# Altium schematic sheet SheetPower.SchDoc
size A3
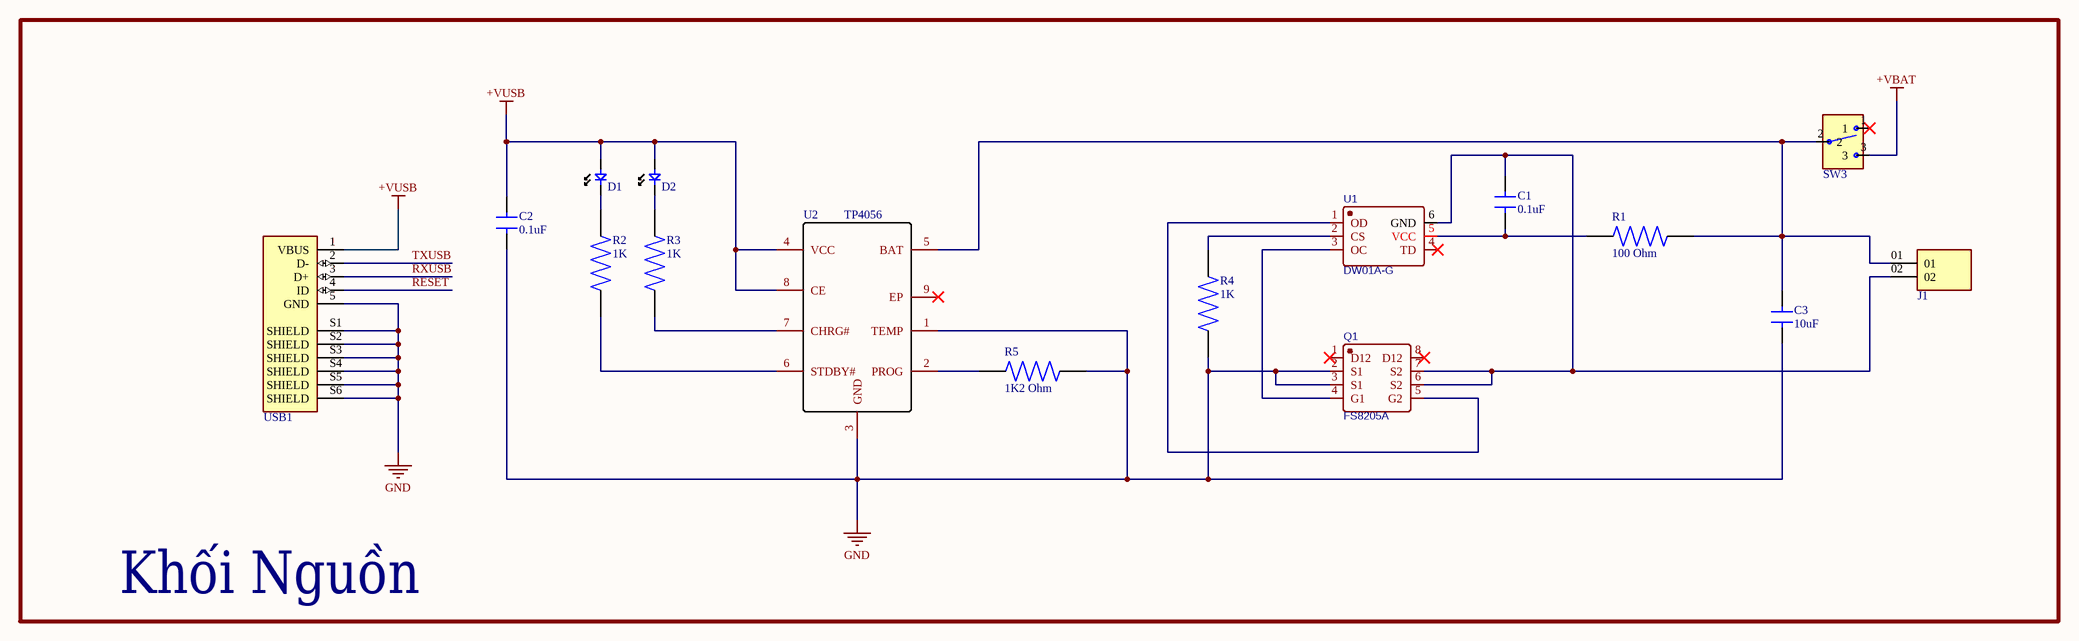
[diagram p0: SheetPower.SchDoc]

## Parts
C1  0.1uF  [CAP104 0.1UF 50V]
C2  0.1uF  [CAP104 0.1UF 50V]
C3  10uF  [CAP104 0.1UF 50V]
D1  LED SM 0805 2V 100MCD RED  [LED 0805]  (value not drawn)
D2  LED SM 0805 2V 100MCD RED  [LED 0805]  (value not drawn)
J1  HTSW-102-07-H-S  [SAMTEC_HTSW-102-07-H-S]  (value not drawn)
Q1  FS8205A  [FS8205A]
R1  100 Ohm  [RC0805 1K OHM]
R2  1K  [RC0805 1K OHM]
R3  1K  [RC0805 1K OHM]
R4  1K  [RC0805 1K OHM]
R5  1K2 Ohm  [RC0805 1K OHM]
SW3  CUS-12TB  [CUS-12B]  (value not drawn)
U1  DW01A-G  [DW01A-G]
U2  TP4056  [TP4056]
USB1  usb micro  [MOLEX_47346-0001]  (value not drawn)

## Blocks framed on the sheet
Khối Nguồn: C1-C3 D1 D2 J1 Q1 R1-R5 SW3 U1 U2 USB1

## Nets
+VBAT: SW3.3
+VUSB: C2.2 D1.A D2.A U2.4(VCC) U2.8(CE) USB1.1(VBUS)
GND: C2.1 C3.1 Q1.2(S1) Q1.3(S1) R4.1 R5.2 U2.1(TEMP) U2.3(GND) USB1.5(GND) USB1.S1(SHIELD) USB1.S2(SHIELD) USB1.S3(SHIELD) USB1.S4(SHIELD) USB1.S5(SHIELD) USB1.S6(SHIELD)
RESET: USB1.4(ID)
RXUSB: USB1.3(D+)
TXUSB: USB1.2(D-)
NetC1_1: C1.1 R1.1 U1.5(VCC)
NetC1_2: C1.2 J1.02 Q1.6(S2) Q1.7(S2) U1.6(GND)
NetC3_2: C3.2 J1.01 R1.2 SW3.2 U2.5(BAT)
NetD1_K: D1.K R2.2
NetD2_K: D2.K R3.2
NetQ1_4: Q1.4(G1) U1.3(OC)
NetQ1_5: Q1.5(G2) U1.1(OD)
NetR2_1: R2.1 U2.6(STDBY#)
NetR3_1: R3.1 U2.7(CHRG#)
NetR4_2: R4.2 U1.2(CS)
NetR5_1: R5.1 U2.2(PROG)

Not connected (* = marked no-connect by the designer): Q1 1(D12)* 8(D12)*; SW3 1*; U1 4(TD)*; U2 9(EP)*

## Library data of the parts
C1 C2 = C0805C104K5RACTU: Cap Ceramic 0.1uF 50V X7R 10% SMD 2.0 x 1.2 mm 125 C Paper T/R; Manufacturer: KEMET; Capacitance: 100nF; Voltage: 500V; Supplier 1: Digi-Key; Manufacturer Part Number: C0805C104K5RACTU; Stock 1: 2487008; Pricing 1: 1 = 0.16000, 10 = 0.11500, 50 = 0.06540, 100 = 0.05420, 500 = 0.03802, 1000 = 0.03147 (USD); RoHS: Yes; Mount: Surface Mount,PCB; Case/Package: 0805; Number of Pins: 2; Dielectric Material: Ceramic; Case Code (Imperial): 0805; Case Code (Metric): 2012; Contact Plating: Tin,Matte; Min Operating Temperature: -55°C; Max Operating Temperature: 125°C; Tolerance: 10%; Packaging: Tape and Reel; Voltage Rating (DC): 50V; Dielectric: X7R; Termination: SMD/SMT; Package Quantity: 4000; Voltage Rating: 50V; Length: 2mm; Height: 0.9mm; Width: 1.2mm; Lead Pitch: 0.75mm; Depth: 1.25mm; Thickness: 0.035inch; Radiation Hardening: No; REACH SVHC: No SVHC; ComponentLink1URL: https://datasheet.ciiva.com/14589/70095383-14589048.pdf?src-supplier=Allied+Electronics; ComponentLink1Description: https://datasheet.ciiva.com/14589/70095383-14589048.pdf?src-supplier=Allied+Electronics; ComponentLink2URL: https://datasheet.ciiva.com/28682/1851736-28682232.pdf?src-supplier=Element14; ComponentLink2Description: https://datasheet.ciiva.com/28682/1851736-28682232.pdf?src-supplier=Element14; ComponentLink3URL: https://datasheet.ciiva.com/32431/slceramic-chip-condensers-e-32431755.pdf?src-supplier=Distrelec; ComponentLink3Description: https://datasheet.ciiva.com/32431/slceramic-chip-condensers-e-32431755.pdf?src-supplier=Distrelec; ComponentLink4URL: https://datasheet.ciiva.com/18410/70095383-18410815.pdf?src-supplier=Allied+Electronics; ComponentLink4Description: https://datasheet.ciiva.com/18410/70095383-18410815.pdf?src-supplier=Allied+Electronics; Supplier Part Number 1: 399-1170-1-ND
C3 = CC0805ZKY5V6BB106: CAP CER 10UF 10V Y5V 0805; Manufacturer: Yageo; Dielectric Material: Ceramic; Tolerance: 80%; Dissipation Factor: 20%; Supplier 1: Digi-Key; Manufacturer Part Number: CC0805ZKY5V6BB106; Stock 1: 2294; Pricing 1: 1 = 0.21000, 10 = 0.14700, 50 = 0.08320, 100 = 0.06900, 500 = 0.04834, 1000 = 0.04002 (USD); RoHS: Yes; Mount: Surface Mount; Case/Package: 0805; Number of Pins: 2; Case Code (Metric): 2012; Case Code (Imperial): 0805; Min Operating Temperature: -30°C; Max Operating Temperature: 85°C; Package Quantity: 1; Capacitance: 10uF; Voltage Rating: 10V; Packaging: Tape and Reel; Voltage Rating (DC): 10V; Dielectric: Y5V; Termination: SMD/SMT; Resistor Type: Ceramic; Series: CC; Construction: Flat; Length: 2mm; Width: 0.049inch; Height: 0.85mm; Thickness: 0.049inch; Depth: 1.25mm; Radiation Hardening: No; REACH SVHC: No SVHC; Lead Free: Lead Free; Halogen Free: Halogen Free; RoHS Compliant: Yes; ComponentLink1URL: https://datasheet.ciiva.com/11465/upy-gphc-y5v-6-3v-to-50v-5-11465832.pdf?src-supplier=Avnet; ComponentLink1Description: https://datasheet.ciiva.com/11465/upy-gphc-y5v-6-3v-to-50v-5-11465832.pdf?src-supplier=Avnet; ComponentLink2URL: https://datasheet.ciiva.com/16624/upy-gphc-y5v-6-3v-to-50v-5-16624678.pdf?src-supplier=Avnet+Europe; ComponentLink2Description: https://datasheet.ciiva.com/16624/upy-gphc-y5v-6-3v-to-50v-5-16624678.pdf?src-supplier=Avnet+Europe; ComponentLink3URL: https://datasheet.ciiva.com/28450/1132289-28450847.pdf?src-supplier=Element14; ComponentLink3Description: https://datasheet.ciiva.com/28450/1132289-28450847.pdf?src-supplier=Element14; ComponentLink4URL: https://datasheet.ciiva.com/156/mlccorderingcode-156385.pdf?src-supplier=Digi-Key; ComponentLink4Description: https://datasheet.ciiva.com/156/mlccorderingcode-156385.pdf?src-supplier=Digi-Key; ComponentLink5URL: https://datasheet.ciiva.com/156/mlccorderingcode-156384.pdf?src-supplier=Digi-Key; ComponentLink5Description: https://datasheet.ciiva.com/156/mlccorderingcode-156384.pdf?src-supplier=Digi-Key; ComponentLink6URL: https://datasheet.ciiva.com/156/mlccorderingcode-156386.pdf?src-supplier=Digi-Key; ComponentLink6Description: https://datasheet.ciiva.com/156/mlccorderingcode-156386.pdf?src-supplier=Digi-Key; Supplier Part Number 1: 311-1355-1-ND
D1 D2 = LSM0805412V: Red 625nm LED Indication - Discrete 2V 0805 (2012 Metric); Manufacturer: Visual Communications; Supplier 1: Digi-Key; Manufacturer Part Number: LSM0805412V; Stock 1: 1900; Pricing 1: 1 = 0.47000, 10 = 0.34000, 100 = 0.15120, 500 = 0.10584, 1000 = 0.08694 (USD); RoHS: No; Supplier Part Number 1: 28-LSM0805412VCT-ND
J1 = HTSW-102-07-H-S: Headers & Wire Housings High Temperature PCB Header Strips, 0.100 pitch; Manufacturer: Samtec; Number of Contacts: 2; Gender: Male; Pitch: 2.54mm; Supplier 1: Digi-Key; Manufacturer Part Number: HTSW-102-07-H-S; Stock 1: 0; Pricing 1: 1 = 0.67000 (USD); RoHS: Yes; Mount: Through Hole; Contact Plating: Gold; Number of Rows: 1; Packaging: Bulk; Termination: Solder; Radiation Hardening: No; RoHS Compliant: Yes; ComponentLink1URL: https://datasheet.ciiva.com/10279/htsw-th-10279801.pdf?src-supplier=Avnet; ComponentLink1Description: https://datasheet.ciiva.com/10279/htsw-th-10279801.pdf?src-supplier=Avnet; Supplier Part Number 1: HTSW-102-07-H-S-ND
Q1 = FS8205A: BOM_Manufacturer: FORTUNE; BOM_Supplier: LCSC; BOM_Manufacturer Part: FS8205A; BOM_Supplier Part: C16052; BOM_JLCPCB Part Class: Extended Part; spicePre: Q; spiceSymbolName: FS8205A
R1 = RC0805FR-07100RL: 贴片电阻 100Ω ± 1.00% 0.125W ± 100ppm/℃ 0805; Manufacturer: Yageo; Resistance: 100R; Tolerance: 1%; Temperature Coefficient: 100ppm/°C; Power Rating: 125mW; Voltage Rating: 150V; Application(s): HIGH RELIABILITY; Supplier 1: Digi-Key; Manufacturer Part Number: RC0805FR-07100RL; Stock 1: 309360; Pricing 1: 1 = 0.10000, 10 = 0.04200, 100 = 0.01690, 1000 = 0.00759, 2500 = 0.00659 (USD); RoHS: Yes; Case/Package: 0805; Number of Pins: 2; Case Code (Imperial): 0805; Case Code (Metric): 2012; Weight: 0.000917oz; Min Operating Temperature: -55°C; Max Operating Temperature: 155°C; Packaging: Cut Tape; Resistor Type: Thick Film; Voltage Rating (DC): 150V; Package Quantity: 5000; Termination: SMD/SMT; Number of Terminations: 2; Max Power Dissipation: 125mW; Features: Moisture Resistant; Series: RC; Technology: THICK FILM; Type: General Purpose; Length: 2mm; Width: 1.25mm; Height: 0.5mm; Depth: 1.25mm; Lead Pitch: 0.4mm; REACH SVHC: Unknown; Lead Free: Lead Free; RoHS Compliant: Yes; Military Standard: Not; ComponentLink1URL: https://datasheet.ciiva.com/11808/0900766b8106beab-11808877.pdf?src-supplier=RSComponents; ComponentLink1Description: https://datasheet.ciiva.com/11808/0900766b8106beab-11808877.pdf?src-supplier=RSComponents; ComponentLink2URL: https://datasheet.ciiva.com/7941/1697719-7941680.pdf?src-supplier=Element14; ComponentLink2Description: https://datasheet.ciiva.com/7941/1697719-7941680.pdf?src-supplier=Element14; ComponentLink3URL: https://datasheet.ciiva.com/7660/38627-7660797.pdf?src-supplier=Element14; ComponentLink3Description: https://datasheet.ciiva.com/7660/38627-7660797.pdf?src-supplier=Element14; ComponentLink4URL: https://datasheet.ciiva.com/2456/pyu-r-int-thick-7-2456987.pdf?src-supplier=Digi-Key; ComponentLink4Description: https://datasheet.ciiva.com/2456/pyu-r-int-thick-7-2456987.pdf?src-supplier=Digi-Key; ComponentLink5URL: https://datasheet.ciiva.com/17082/rc0805-17082697.pdf?src-supplier=Future+Electronics; ComponentLink5Description: https://datasheet.ciiva.com/17082/rc0805-17082697.pdf?src-supplier=Future+Electronics; ComponentLink6URL: https://datasheet.ciiva.com/7941/1686128-7941679.pdf?src-supplier=Element14; ComponentLink6Description: https://datasheet.ciiva.com/7941/1686128-7941679.pdf?src-supplier=Element14; ComponentLink7URL: https://datasheet.ciiva.com/22747/444164-22747535.pdf?src-supplier=Element14; ComponentLink7Description: https://datasheet.ciiva.com/22747/444164-22747535.pdf?src-supplier=Element14; ComponentLink8URL: https://datasheet.ciiva.com/46447/444164-46447562.pdf?src-supplier=Element14; ComponentLink8Description: https://datasheet.ciiva.com/46447/444164-46447562.pdf?src-supplier=Element14; ComponentLink9URL: https://datasheet.ciiva.com/2456/pyu-r-int-thick-7-2456988.pdf?src-supplier=Digi-Key; ComponentLink9Description: https://datasheet.ciiva.com/2456/pyu-r-int-thick-7-2456988.pdf?src-supplier=Digi-Key; ComponentLink10URL: https://datasheet.ciiva.com/2456/pyu-r-int-thick-7-2456989.pdf?src-supplier=Digi-Key; ComponentLink10Description: https://datasheet.ciiva.com/2456/pyu-r-int-thick-7-2456989.pdf?src-supplier=Digi-Key; Supplier Part Number 1: 311-100CRCT-ND
R2-R4 = RC0805FR-071KL: 贴片电阻 1000Ω ± 1.00% 0.125W ± 100ppm/℃ 0805; Manufacturer: Yageo; Resistance: 1kR; Tolerance: 1%; Temperature Coefficient: 100ppm/°C; Power Rating: 125mW; Voltage Rating (DC): 150V; Supplier 1: Digi-Key; Manufacturer Part Number: RC0805FR-071KL; Stock 1: 4142320; Pricing 1: 5000 = 0.00544 (USD); RoHS: Yes; Case/Package: 0805; Number of Pins: 2; Case Code (Metric): 2012; Case Code (Imperial): 0805; Size Code: 0805; Min Operating Temperature: -55°C; Max Operating Temperature: 155°C; Packaging: Tape and Reel; Resistor Type: Thick Film; Package Quantity: 1; Voltage Rating: 150V; Number of Terminations: 2; Termination: SMD/SMT; Max Power Dissipation: 125mW; Features: Moisture Resistant; Series: RC; Resistance Tolerance: 1%; Construction: Rectangular; Length: 0.079inch; Width: 0.049inch; Height: 0.024inch; Depth: 1.25mm; REACH SVHC: Unknown; Lead Free: Lead Free; Military Standard: Not; RoHS Compliant: Yes; Supplier Part Number 1: 311-1.00KCRTR-ND
R5 = CRCW08051K20FKTA: Res Thick Film 0805 1.2K Ohm 1% 1/8W ±100ppm/°C Molded SMD SMD Paper T/R; Manufacturer: Vishay Dale; Resistance: 1.2kR; Power Rating: 125mW; Voltage Rating: 150V; Supplier 1: Digi-Key; Manufacturer Part Number: CRCW08051K20FKTA; Stock 1: 0; Pricing 1: 5000 = 0.01898 (USD); RoHS: No; Case/Package: 0805; Weight: 0.000194oz; Case Code (Metric): 2012; Case Code (Imperial): 0805; Contact Plating: Tin,Lead; Min Operating Temperature: -55°C; Max Operating Temperature: 155°C; Package Quantity: 5000; Tolerance: 1%; Packaging: Tape and Reel; Resistor Type: Thick Film; Number of Terminations: 2; Max Power Dissipation: 125mW; Temperature Coefficient: 100ppm/°C; Voltage Rating (DC): 150V; Features: Automotive AEC-Q200; Series: CRCW; Length: 0.079inch; Width: 0.049inch; Height: 0.02inch; Radiation Hardening: No; Lead Free: Contains Lead; RoHS Compliant: No; ComponentLink1URL: https://datasheet.ciiva.com/2567/dcrcw-2567141.pdf?src-supplier=Digi-Key; ComponentLink1Description: https://datasheet.ciiva.com/2567/dcrcw-2567141.pdf?src-supplier=Digi-Key; ComponentLink2URL: https://datasheet.ciiva.com/9105/dcrcw-9105595.pdf?src-supplier=Avnet; ComponentLink2Description: https://datasheet.ciiva.com/9105/dcrcw-9105595.pdf?src-supplier=Avnet; Supplier Part Number 1: CRCW08051K20FKTA-ND
SW3 = CUS-12TB: Switch Slide SPDT Side Slide 0.3A 20VDC Gull Wing SMD Embossed T/R; Manufacturer: Nidec Copal; Actuator Material: Nylon,Polyamide; Voltage Rating (DC): 4V; Current Rating: 300mA; Operating Force: 204gf; Max Voltage Rating (DC): 20V; Contact Style: Non-Shorting; Electrical Life: 10000Cycles; Switch Travel: 1.5mm; Switch Function: On-On; Actuator Type: Standard; Supplier 1: Digi-Key; Manufacturer Part Number: CUS-12TB; Stock 1: 30577; Pricing 1: 1 = 0.70000, 10 = 0.67600, 25 = 0.65040, 100 = 0.56450, 250 = 0.51504, 500 = 0.47864, 1000 = 0.42921 (USD); RoHS: Yes; Mount: Surface Mount; Contact Material: Copper Alloy; Contact Plating: Gold; Min Operating Temperature: -20°C; Max Operating Temperature: 70°C; Packaging: Tape and Reel; Throw Configuration: SPDT; Termination: Gull Wing; Orientation: Right Angle; Series: CUS; Actuator Length: 1.5mm; Radiation Hardening: No; RoHS Compliant: Yes; ComponentLink1URL: https://datasheet.ciiva.com/2889/cus-2889431.pdf?src-supplier=Digi-Key; ComponentLink1Description: https://datasheet.ciiva.com/2889/cus-2889431.pdf?src-supplier=Digi-Key; ComponentLink2URL: https://datasheet.ciiva.com/2889/cus-2889432.pdf?src-supplier=Digi-Key; ComponentLink2Description: https://datasheet.ciiva.com/2889/cus-2889432.pdf?src-supplier=Digi-Key; ComponentLink3URL: https://datasheet.ciiva.com/2889/cus-2889433.pdf?src-supplier=Digi-Key; ComponentLink3Description: https://datasheet.ciiva.com/2889/cus-2889433.pdf?src-supplier=Digi-Key; Supplier Part Number 1: 563-1102-1-ND
U1 = DW01A-G: BOM_Manufacturer: FORTUNE; Contributor: LCSC; BOM_Supplier: LCSC; BOM_Manufacturer Part: DW01A-G; BOM_Supplier Part: C61503; BOM_JLCPCB Part Class: Extended Part; spicePre: U; spiceSymbolName: DW01A-G
U2 = TP4056: Vcc=6V Ic=1A; Manufacturer: TPOWER; Supplier 1: LCSC; Manufacturer Part Number: TP4056; Stock 1: 58255; Pricing 1: 5 = 0.16270, 50 = 0.13430, 150 = 0.11370, 500 = 0.09670, 2500 = 0.09380, 5000 = 0.09240 (USD); RoHS: No; Supplier Part Number 1: C382139
USB1 = 47346-0001: Micro-USB B Receptacle with Flange, Bottom Mount, Surface Mount, Lead-Free; Manufacturer: Molex; Number of Terminals/Pins: 5; Gender: Female; Max Voltage Rating (AC): 30V; Connector Type: USB,Receptacle; Number of Ports: 1; Contact Resistance: 40mR; Current Rating: 1.8A; Contact Current Rating: 1A; USB Standard: USB 2.0; Pitch: 0.65mm; Glow Wire Compliant: Non-compliant; Supplier 1: Digi-Key; Manufacturer Part Number: 47346-0001; Stock 1: 138; Pricing 1: 1 = 1.10000, 10 = 0.91200, 100 = 0.75980, 1000 = 0.60782 (USD); RoHS: Yes; Mount: Surface Mount; Contact Plating: Gold; Contact Material: Copper Alloy,Copper; Housing Material: Polymer; Color: Black; Weight: 0.01lb; Min Operating Temperature: -20°C; Max Operating Temperature: 85°C; Packaging: Tape and Reel; Termination: SMD/SMT; Number of Contacts: 5; Orientation: Right Angle; Series: 47346; Voltage Rating (AC): 30V; Voltage Rating: 30V; Number of Circuits: 5; Number of Positions: 5; Number of Rows: 1; Length: 7.8mm; Width: 0.25inch; Height: 0.25inch; REACH SVHC: Unknown; Halogen Free: Low Halogen; Lead Free: Lead Free; Flammability Rating: UL94 V-0; ComponentLink1URL: https://datasheet.ciiva.com/1098/1698067-1098476.pdf?src-supplier=Element14; ComponentLink1Description: https://datasheet.ciiva.com/1098/1698067-1098476.pdf?src-supplier=Element14; ComponentLink2URL: https://datasheet.ciiva.com/22654/1630785-22654942.pdf?src-supplier=Element14; ComponentLink2Description: https://datasheet.ciiva.com/22654/1630785-22654942.pdf?src-supplier=Element14; ComponentLink3URL: https://datasheet.ciiva.com/16148/1700180473460001-io-nectors-16148917.pdf?src-supplier=Onlinecomponents.com; ComponentLink3Description: https://datasheet.ciiva.com/16148/1700180473460001-io-nectors-16148917.pdf?src-supplier=Onlinecomponents.com; ComponentLink4URL: https://datasheet.ciiva.com/30075/304740473460001-io-nectors-30075527.pdf?src-supplier=Onlinecomponents.com; ComponentLink4Description: https://datasheet.ciiva.com/30075/304740473460001-io-nectors-30075527.pdf?src-supplier=Onlinecomponents.com; ComponentLink5URL: https://datasheet.ciiva.com/4598/0473460001-io-connectors-146446-4598841.pdf?src-supplier=Mouser; ComponentLink5Description: https://datasheet.ciiva.com/4598/0473460001-io-connectors-146446-4598841.pdf?src-supplier=Mouser; ComponentLink6URL: https://datasheet.ciiva.com/11731/0900766b80dfe0a7-11731298.pdf?src-supplier=RSComponents; ComponentLink6Description: https://datasheet.ciiva.com/11731/0900766b80dfe0a7-11731298.pdf?src-supplier=RSComponents; ComponentLink7URL: https://datasheet.ciiva.com/28504/0473460001-io-connectors-28504587.pdf?src-supplier=Element14; ComponentLink7Description: https://datasheet.ciiva.com/28504/0473460001-io-connectors-28504587.pdf?src-supplier=Element14; ComponentLink8URL: https://datasheet.ciiva.com/46390/1681853-46390956.pdf?src-supplier=Element14; ComponentLink8Description: https://datasheet.ciiva.com/46390/1681853-46390956.pdf?src-supplier=Element14; ComponentLink9URL: https://datasheet.ciiva.com/16986/70266948-16986683.pdf?src-supplier=Allied+Electronics; ComponentLink9Description: https://datasheet.ciiva.com/16986/70266948-16986683.pdf?src-supplier=Allied+Electronics; Supplier Part Number 1: WM17141CT-ND